# Altium schematic sheet Main_DLS.SchDoc: DLS Main Board
size 254 x 177 mm; Author: hdiushdaisd; DrawnBy: Artur Bereit; Revision: 1.1; SheetNumber: 1; SheetTotal: 4; SPICEModelCacheWKBDPPFP: <root> / <DocumentId>WKBDPPFP</DocumentId> / </root>
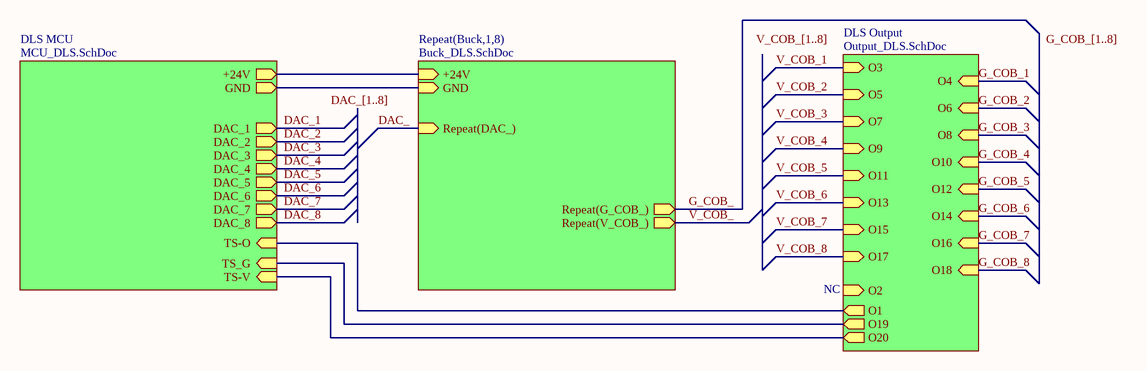
[diagram p0: Main_DLS.SchDoc]

## Sub-sheets
DLS MCU = MCU_DLS.SchDoc: DAC_1 (out), DAC_2 (out), DAC_3 (out), DAC_4 (out), DAC_5 (out), DAC_6 (out), DAC_7 (out), DAC_8 (out), TS-O (in), TS_G (in), TS-V (in), +24V (out), GND (out)
DLS Output = Output_DLS.SchDoc: O1 (out), O2 (in), O3 (in), O4 (in), O5 (in), O6 (in), O7 (in), O8 (in), O9 (in), O10 (in), O11 (in), O12 (in), O13 (in), O14 (in), O15 (in), O16 (in), O17 (in), O18 (in), O19 (out), O20 (out)
Repeat(Buck,1,8) = Buck_DLS.SchDoc: Repeat(DAC_) (in), Repeat(G_COB_) (out), Repeat(V_COB_) (out), GND (in), +24V (in)

## Nets
DAC_: sheet Repeat(Buck,1,8)/Repeat(DAC_)
DAC_1: sheet DLS MCU/DAC_1
DAC_2: sheet DLS MCU/DAC_2
DAC_3: sheet DLS MCU/DAC_3
DAC_4: sheet DLS MCU/DAC_4
DAC_5: sheet DLS MCU/DAC_5
DAC_6: sheet DLS MCU/DAC_6
DAC_7: sheet DLS MCU/DAC_7
DAC_8: sheet DLS MCU/DAC_8
G_COB_: sheet Repeat(Buck,1,8)/Repeat(G_COB_)
G_COB_1: sheet DLS Output/O4
G_COB_2: sheet DLS Output/O6
G_COB_3: sheet DLS Output/O8
G_COB_4: sheet DLS Output/O10
G_COB_5: sheet DLS Output/O12
G_COB_6: sheet DLS Output/O14
G_COB_7: sheet DLS Output/O16
G_COB_8: sheet DLS Output/O18
V_COB_: sheet Repeat(Buck,1,8)/Repeat(V_COB_)
V_COB_1: sheet DLS Output/O3
V_COB_2: sheet DLS Output/O5
V_COB_3: sheet DLS Output/O7
V_COB_4: sheet DLS Output/O9
V_COB_5: sheet DLS Output/O11
V_COB_6: sheet DLS Output/O13
V_COB_7: sheet DLS Output/O15
V_COB_8: sheet DLS Output/O17
(unnamed): sheet DLS MCU/TS-O, sheet DLS Output/O1
(unnamed): sheet DLS MCU/TS_G, sheet DLS Output/O19
(unnamed): sheet DLS MCU/TS-V, sheet DLS Output/O20
(unnamed): sheet DLS MCU/+24V, sheet Repeat(Buck,1,8)/+24V
(unnamed): sheet DLS MCU/GND, sheet Repeat(Buck,1,8)/GND

## Buses and harness runs
bus DAC_[1..8]
bus G_COB_[1..8]
bus V_COB_[1..8]

## Notes on the sheet
- NC
- Labels drawn without touching a wire or pin: DAC_[1..8], G_COB_[1..8], V_COB_[1..8]